# EAGLE schematic bandmodule (EAGLE 8.1.0)
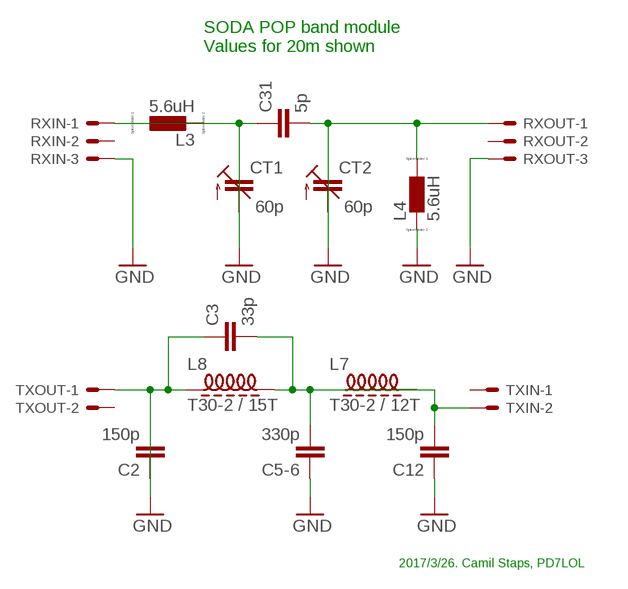
[diagram p0: schematic, sheet 1]

## Parts
C2  150p  C5/2.5  [C5B2.5]
C3  33p  C5/2.5  [C5B2.5]
C5-6  330p  C5/2.5  [C5B2.5]
C12  150p  C5/2.5  [C5B2.5]
C31  5p  C5/2.5  [C5B2.5]
CT1  60p  C-TRIMMTZ03  [CTRIMTZ03]
CT2  60p  C-TRIMMTZ03  [CTRIMTZ03]
L3  5.6uH  L0207/10  [0207/10]
L4  5.6uH  L0207/10  [0207/10]
L7  T30-2 / 12T  INDUCTORT30-2-28AWG-12T  [T30-2-28AWG-12T]
L8  T30-2 / 15T  INDUCTORT30-2-28AWG-12T  [T30-2-28AWG-12T]
RXIN  22-23-2031  [22-23-2031]
RXOUT  22-23-2031  [22-23-2031]
TXIN  22-23-2021  [22-23-2021]
TXOUT  22-23-2021  [22-23-2021]

## Nets
GND: C2.2 C5-6.1 C12.1 CT1.1(E) CT2.1(E) L4.2 RXIN.3 RXOUT.3
N$1: L3.2 RXIN.1
N$2: C31.1 CT1.2(A) L3.1
N$4: C31.2 CT2.2(A) L4.1 RXOUT.1
N$5: C3.2 C5-6.2 L7.P$2 L8.P$2
N$6: C12.2 L7.P$1 TXIN.2
N$8: C2.1 C3.1 L8.P$1 TXOUT.1
Unconnected: RXIN.2 RXOUT.2 TXIN.1 TXOUT.2

## Notes on the sheet
- SODA POP band module
  Values for 20m shown
- 2017/3/26. Camil Staps, PD7LOL

## Library data of the parts
C2 C3 C5-6 C12 C31 = capacitor-wima:C: CAPACITOR naming: grid - package width
CT1 CT2 = rcl:C-TRIMM: Trimm capacitor
L3 L4 = eagle-ltspice:L: INDUCTOR, European symbol; SPICEMODEL: NONE; SPICEPREFIX: L
L7 L8 = toroids:INDUCTOR: Inductor on toroid
RXIN RXOUT = con-molex:22-23-2031: .100" (2.54mm) Center Header - 3 Pin; MF: MOLEX; MPN: 22-23-2031; OC_FARNELL: 1462950; OC_NEWARK: 30C0862
TXIN TXOUT = con-molex:22-23-2021: .100" (2.54mm) Center Header - 2 Pin; MF: MOLEX; MPN: 22-23-2021; OC_FARNELL: 1462926; OC_NEWARK: 25C3832